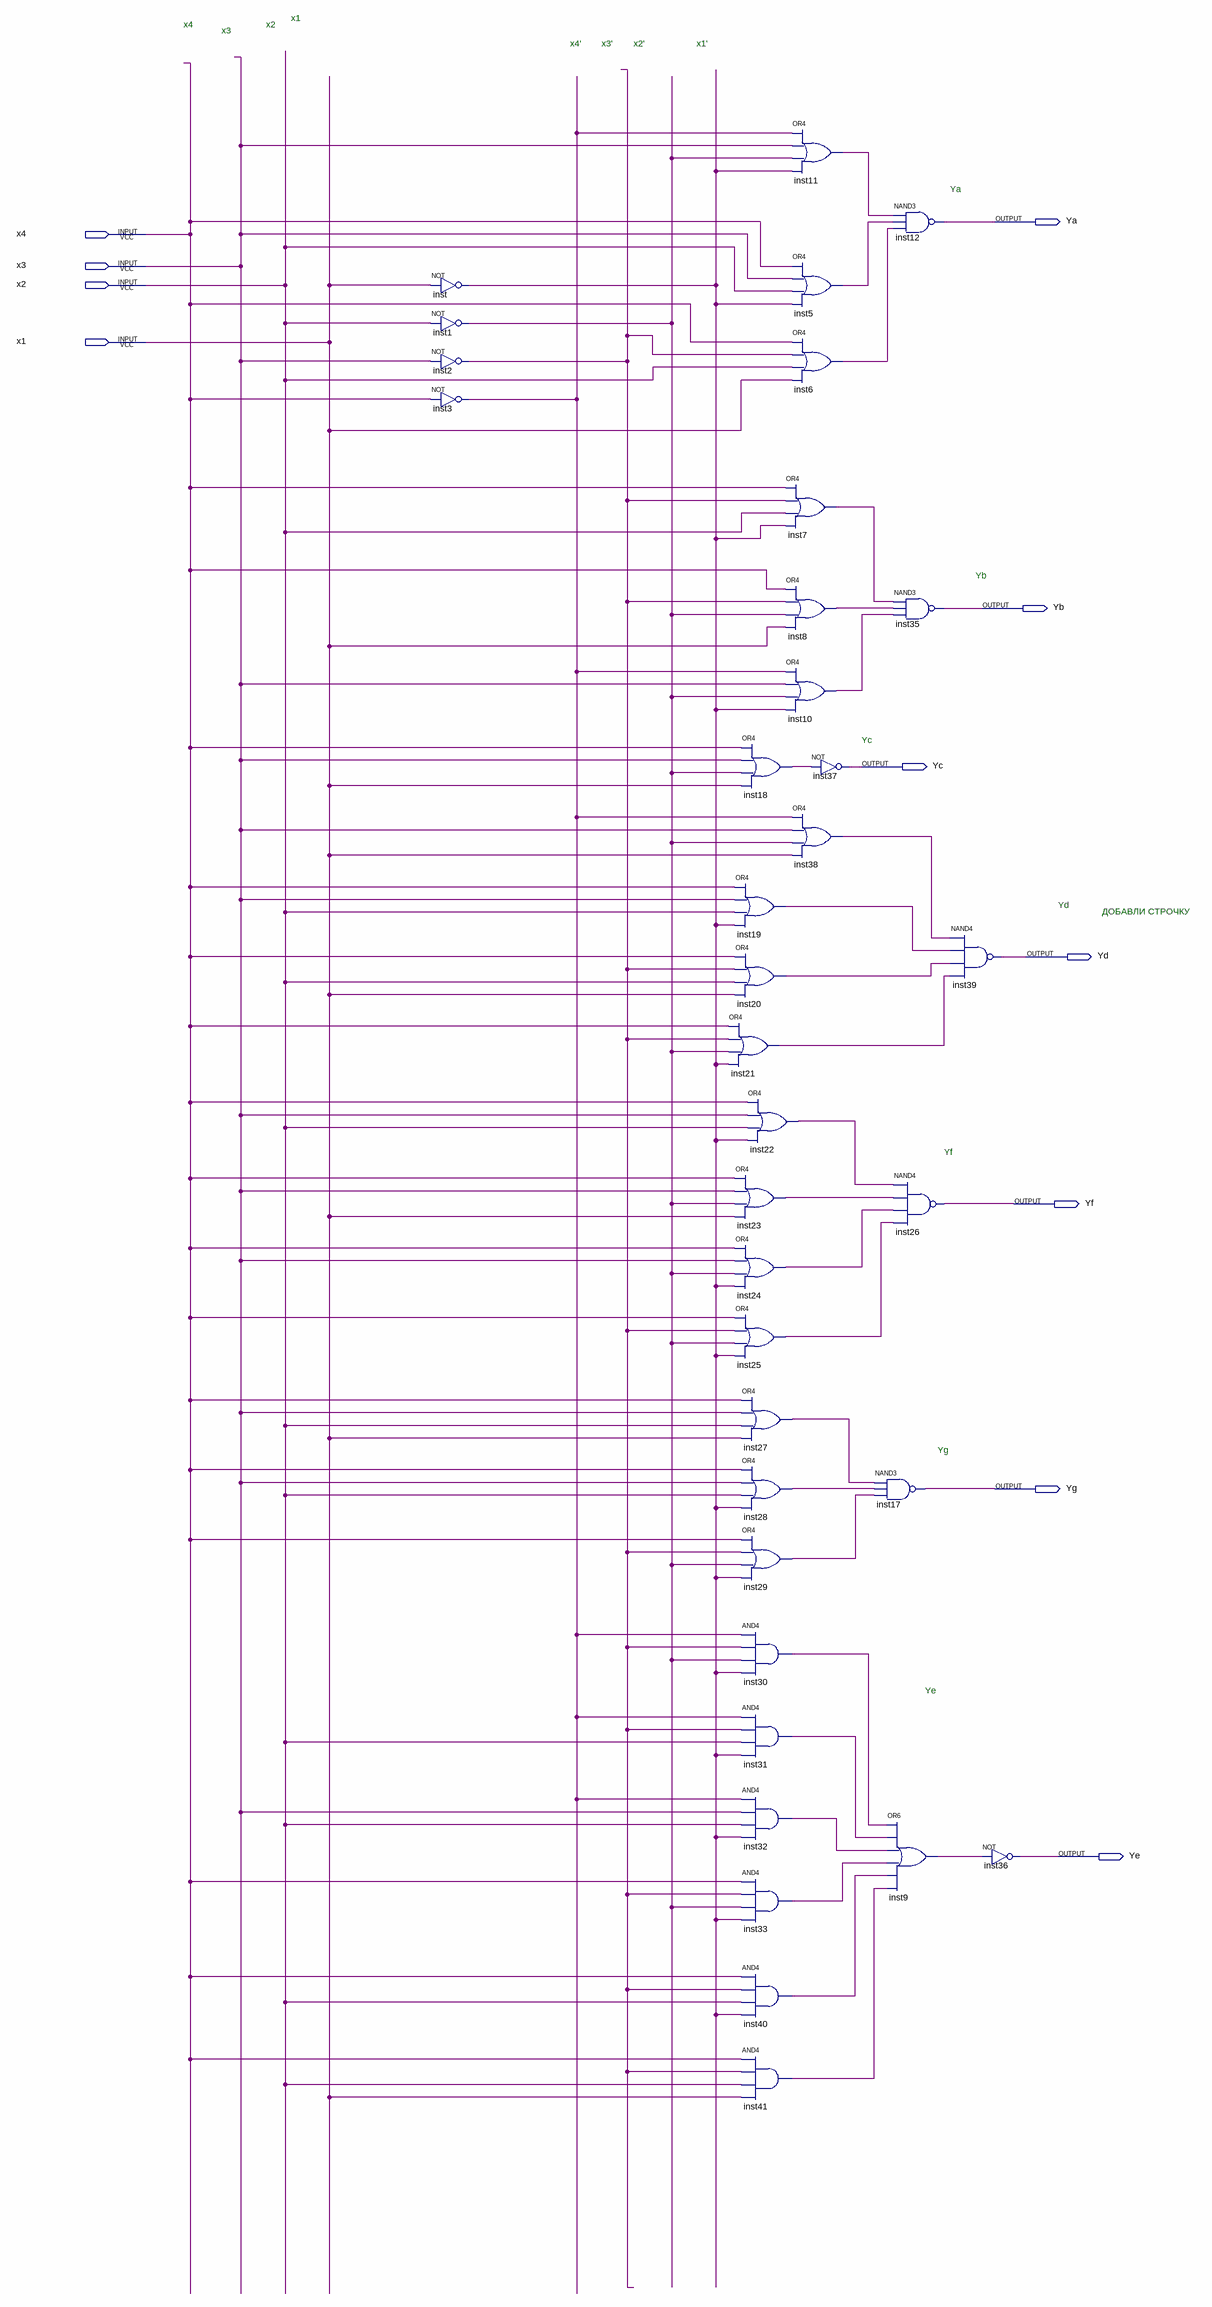
[diagram p0: schematic sheet]
// Quartus schematic indic.bdf as structural Verilog: 36 symbols, 11 pins
module indic (
  input  x4,
  input  x3,
  input  x2,
  input  x1,
  output Ya,
  output Yb,
  output Yc,
  output Yd,
  output Yf,
  output Yg,
  output Ye
);

  wire inst1_out, inst2_out, inst3_out, inst5_out, inst6_out, inst7_out, inst8_out, inst9_out, inst10_out,
       inst11_out, inst18_out, inst19_out, inst20_out, inst21_out, inst22_out, inst23_out, inst24_out,
       inst25_out, inst27_out, inst28_out, inst29_out, inst30_out, inst31_out, inst32_out, inst33_out,
       inst38_out, inst40_out, inst41_out, inst_out;

  not inst (inst_out, x1);
  not inst1 (inst1_out, x2);
  not inst2 (inst2_out, x3);
  not inst3 (inst3_out, x4);
  or inst18 (inst18_out, x4, x3, inst1_out, x1);
  or inst19 (inst19_out, x4, x3, x2, inst_out);
  or inst20 (inst20_out, x4, inst2_out, x2, x1);
  or inst21 (inst21_out, x4, inst2_out, inst1_out, inst_out);
  or inst22 (inst22_out, x4, x3, x2, inst_out);
  or inst23 (inst23_out, x4, x3, inst1_out, x1);
  or inst24 (inst24_out, x4, x3, inst1_out, inst_out);
  or inst25 (inst25_out, x4, inst2_out, inst1_out, inst_out);
  or inst27 (inst27_out, x4, x3, x2, x1);
  or inst28 (inst28_out, x4, x3, x2, inst_out);
  or inst29 (inst29_out, x4, inst2_out, inst1_out, inst_out);
  and inst30 (inst30_out, inst3_out, inst2_out, inst1_out, inst_out);
  and inst31 (inst31_out, inst3_out, inst2_out, x2, inst_out);
  and inst32 (inst32_out, inst3_out, x3, x2, inst_out);
  and inst33 (inst33_out, x4, inst2_out, inst1_out, inst_out);
  and inst40 (inst40_out, x4, inst2_out, x2, inst_out);
  and inst41 (inst41_out, x4, inst2_out, x2, x1);
  or inst11 (inst11_out, inst3_out, x3, inst1_out, inst_out);
  or inst5 (inst5_out, x4, x3, x2, inst_out);
  or inst6 (inst6_out, x4, inst2_out, x2, x1);
  or inst7 (inst7_out, x4, inst2_out, x2, inst_out);
  or inst8 (inst8_out, x4, inst2_out, inst1_out, x1);
  or inst10 (inst10_out, inst3_out, x3, inst1_out, inst_out);
  not inst37 (Yc, inst18_out);
  or inst38 (inst38_out, inst3_out, x3, inst1_out, x1);
  nand inst12 (Ya, inst11_out, inst5_out, inst6_out);
  nand inst35 (Yb, inst7_out, inst8_out, inst10_out);
  nand inst26 (Yf, inst22_out, inst23_out, inst24_out, inst25_out);
  nand inst17 (Yg, inst27_out, inst28_out, inst29_out);
  or inst9 (inst9_out, inst30_out, inst31_out, inst32_out, inst33_out, inst40_out, inst41_out);
  nand inst39 (Yd, inst38_out, inst19_out, inst20_out, inst21_out);
  not inst36 (Ye, inst9_out);

  // Notes on the sheet:
  //   x1
  //   x4
  //   x2
  //   x3
  //   x4'
  //   x3'
  //   x2'
  //   x1'
  //   Ya
  //   Yb
  //   Yc
  //   Yd
  //   ДОБАВЛИ СТРОЧКУ
  //   Yf
  //   Yg
  //   Ye
endmodule
